# Altium schematic sheet FPGA_GPIO.SchDoc
size A; SheetNumber: 2; SheetTotal: 5; Application_BuildNumber: 1
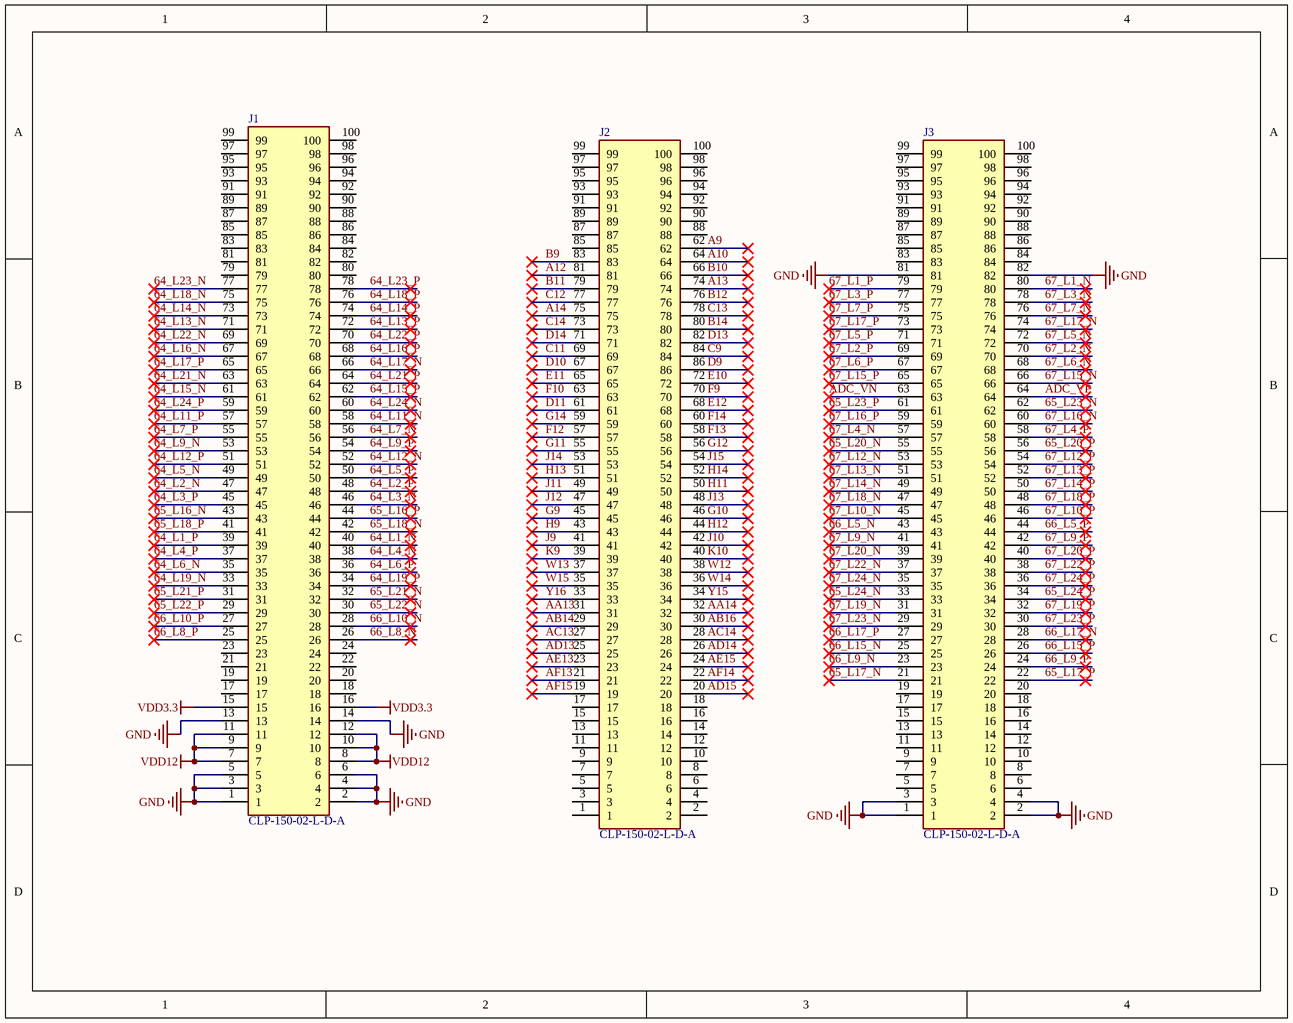
[diagram p0: FPGA_GPIO.SchDoc]

## Parts
J1  CLP-150-02-L-D-A  [CLP-150-02-XXX-D-A]  (no BOM)
J2  CLP-150-02-L-D-A  [CLP-150-02-XXX-D-A]  (no BOM)
J3  CLP-150-02-L-D-A  [CLP-150-02-XXX-D-A]  (no BOM)

## Nets
GND: J1.1 J1.2 J1.3 J1.4 J1.5 J1.6 J1.13 J1.14 J3.1 J3.2 J3.3 J3.4 J3.81 J3.82
VDD3.3: J1.15 J1.16
VDD12: J1.7 J1.8 J1.9 J1.10 J1.11 J1.12
64_L1_N: J1.40
64_L1_P: J1.39
64_L2_N: J1.47
64_L2_P: J1.48
64_L3_N: J1.46
64_L3_P: J1.45
64_L4_N: J1.38
64_L4_P: J1.37
64_L5_N: J1.49
64_L5_P: J1.50
64_L6_N: J1.35
64_L6_P: J1.36
64_L7_N: J1.56
64_L7_P: J1.55
64_L9_N: J1.53
64_L9_P: J1.54
64_L11_N: J1.58
64_L11_P: J1.57
64_L12_N: J1.52
64_L12_P: J1.51
64_L13_N: J1.71
64_L13_P: J1.72
64_L14_N: J1.73
64_L14_P: J1.74
64_L15_N: J1.61
64_L15_P: J1.62
64_L16_N: J1.67
64_L16_P: J1.68
64_L17_N: J1.66
64_L17_P: J1.65
64_L18_N: J1.75
64_L18_P: J1.76
64_L19_N: J1.33
64_L19_P: J1.34
64_L21_N: J1.63
64_L21_P: J1.64
64_L22_N: J1.69
64_L22_P: J1.70
64_L23_N: J1.77
64_L23_P: J1.78
64_L24_N: J1.60
64_L24_P: J1.59
65_L16_N: J1.43
65_L16_P: J1.44
65_L17_N: J3.21
65_L17_P: J3.22
65_L18_N: J1.42
65_L18_P: J1.41
65_L20_N: J3.55
65_L20_P: J3.56
65_L21_N: J1.32
65_L21_P: J1.31
65_L22_N: J1.30
65_L22_P: J1.29
65_L23_N: J3.62
65_L23_P: J3.61
65_L24_N: J3.33
65_L24_P: J3.34
66_L5_N: J3.43
66_L5_P: J3.44
66_L8_N: J1.26
66_L8_P: J1.25
66_L9_N: J3.23
66_L9_P: J3.24
66_L10_N: J1.28
66_L10_P: J1.27
66_L15_N: J3.25
66_L15_P: J3.26
66_L17_N: J3.28
66_L17_P: J3.27
67_L1_N: J3.80
67_L1_P: J3.79
67_L2_N: J3.70
67_L2_P: J3.69
67_L3_N: J3.78
67_L3_P: J3.77
67_L4_N: J3.57
67_L4_P: J3.58
67_L5_N: J3.72
67_L5_P: J3.71
67_L6_N: J3.68
67_L6_P: J3.67
67_L7_N: J3.76
67_L7_P: J3.75
67_L9_N: J3.41
67_L9_P: J3.42
67_L10_N: J3.45
67_L10_P: J3.46
67_L12_N: J3.53
67_L12_P: J3.54
67_L13_N: J3.51
67_L13_P: J3.52
67_L14_N: J3.49
67_L14_P: J3.50
67_L15_N: J3.66
67_L15_P: J3.65
67_L16_N: J3.60
67_L16_P: J3.59
67_L17_N: J3.74
67_L17_P: J3.73
67_L18_N: J3.47
67_L18_P: J3.48
67_L19_N: J3.31
67_L19_P: J3.32
67_L20_N: J3.39
67_L20_P: J3.40
67_L22_N: J3.37
67_L22_P: J3.38
67_L23_N: J3.29
67_L23_P: J3.30
67_L24_N: J3.35
67_L24_P: J3.36
A9: J2.62
A10: J2.64
A12: J2.81
A13: J2.74
A14: J2.75
AA13: J2.31
AA14: J2.32
AB14: J2.29
AB16: J2.30
AC13: J2.27
AC14: J2.28
AD13: J2.25
AD14: J2.26
AD15: J2.20
ADC_VN: J3.63
ADC_VP: J3.64
AE13: J2.23
AE15: J2.24
AF13: J2.21
AF14: J2.22
AF15: J2.19
B9: J2.83
B10: J2.66
B11: J2.79
B12: J2.76
B14: J2.80
C9: J2.84
C11: J2.69
C12: J2.77
C13: J2.78
C14: J2.73
D9: J2.86
D10: J2.67
D11: J2.61
D13: J2.82
D14: J2.71
E10: J2.72
E11: J2.65
E12: J2.68
F9: J2.70
F10: J2.63
F12: J2.57
F13: J2.58
F14: J2.60
G9: J2.45
G10: J2.46
G11: J2.55
G12: J2.56
G14: J2.59
H9: J2.43
H11: J2.50
H12: J2.44
H13: J2.51
H14: J2.52
J9: J2.41
J10: J2.42
J11: J2.49
J12: J2.47
J13: J2.48
J14: J2.53
J15: J2.54
K9: J2.39
K10: J2.40
W12: J2.38
W13: J2.37
W14: J2.36
W15: J2.35
Y15: J2.34
Y16: J2.33

Not connected (* = marked no-connect by the designer): J1 17 18 19 20 21 22 23 24 79 80 81 82 83 84 85 86 87 88 89 90 91 92 93 94 95 96 97 98 99 100; J2 1 2 3 4 5 6 7 8 9 10 11 12 13 14 15 16 17 18 85 87 88 89 90 91 92 93 94 95 96 97 98 99 100; J3 5 6 7 8 9 10 11 12 13 14 15 16 17 18 19 20 83 84 85 86 87 88 89 90 91 92 93 94 95 96 97 98 99 100

## Library data of the parts
J1-J3 = CLP-150-02-L-D-A: Connector; Manufacturer_Name: SAMTEC; Datasheet Link: http://suddendocs.samtec.com/prints/erm8-xxx-xx.x-xxx-dv-xxxx-xx-mkt.pdf; Height: 2.37mm; Manufacturer_Part_Number: CLP-150-02-L-D-A
  J2: Parameter 1: *